# EAGLE schematic amp01 (EAGLE 6.1)
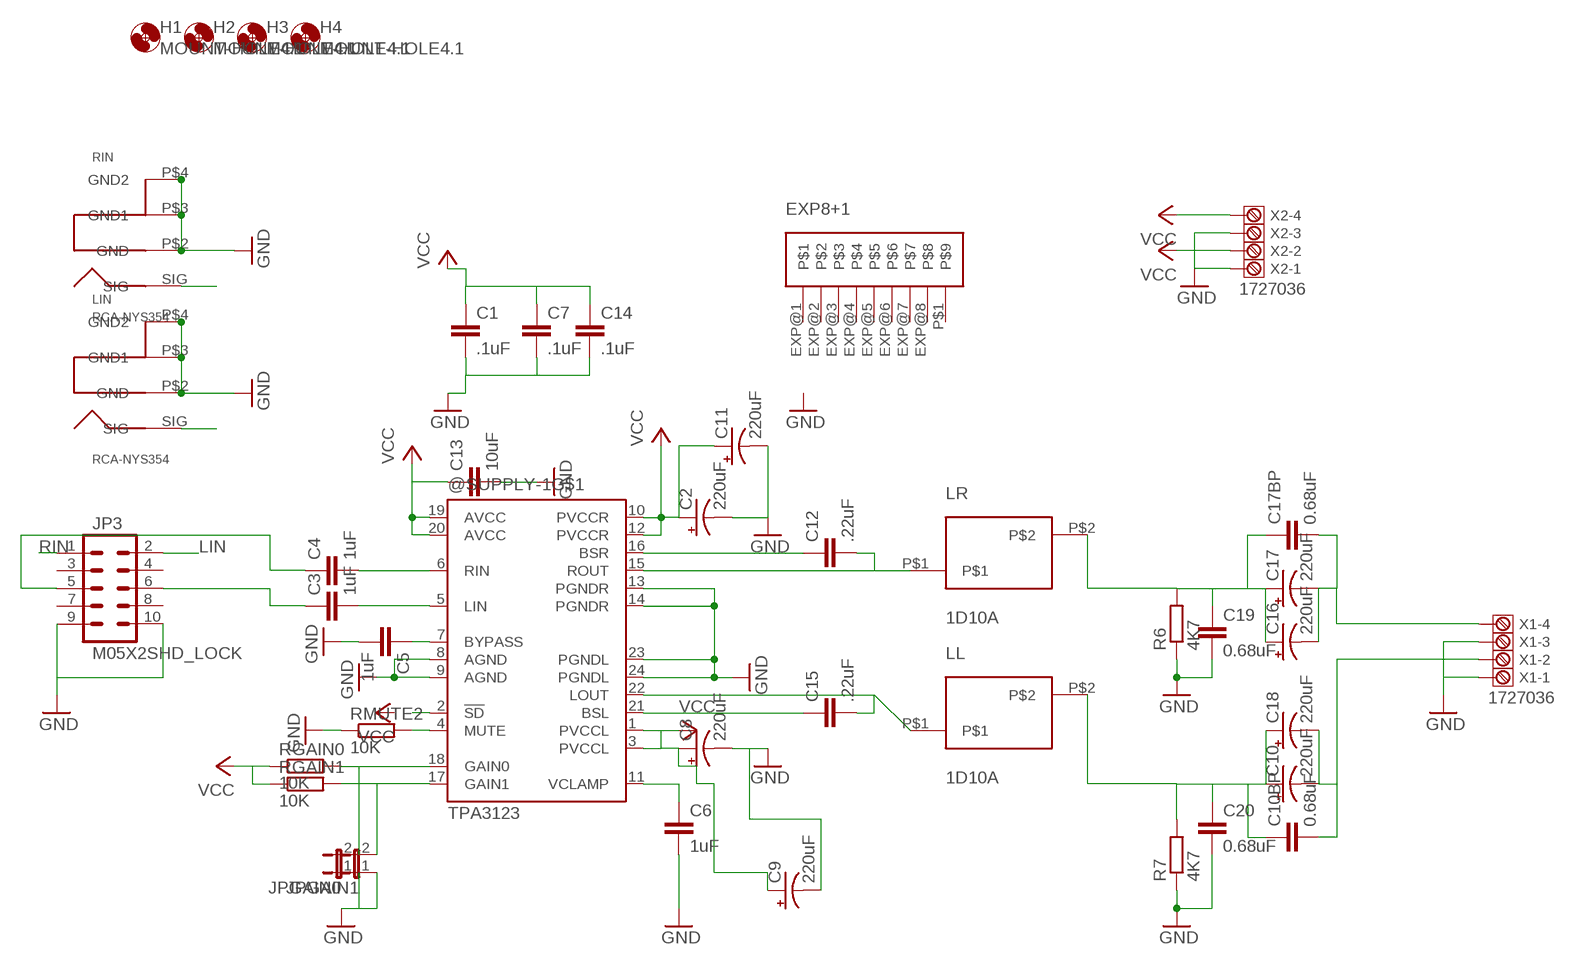
[diagram p0: schematic, sheet 1]

## Parts
@SUPPLY-1  TPA3123  [PWP-TSSOP24]
C1  .1uF  C-EUC0805  [C0805]
C2  220uF  CPOL-USF  [PANASONIC_F]
C3  1uF  C-EU102_152-062X184  [C102_152-062X184]
C4  1uF  C-EU102_152-062X184  [C102_152-062X184]
C5  1uF  C-EUC0805  [C0805]
C6  1uF  C-EUC0805  [C0805]
C7  .1uF  C-EUC0805  [C0805]
C8  220uF  CPOL-USF  [PANASONIC_F]
C9  220uF  CPOL-USF  [PANASONIC_F]
C10  220uF  CPOL-USF  [PANASONIC_F]
C10BP  0.68uF  C-EU050-055X075  [C050-055X075]
C11  220uF  CPOL-USF  [PANASONIC_F]
C12  .22uF  C-EUC0805  [C0805]
C13  10uF  C-EUC1210  [C1210]
C14  .1uF  C-EUC0805  [C0805]
C15  .22uF  C-EUC0805  [C0805]
C16  220uF  CPOL-USF  [PANASONIC_F]
C17  220uF  CPOL-USF  [PANASONIC_F]
C17BP  0.68uF  C-EU050-055X075  [C050-055X075]
C18  220uF  CPOL-USF  [PANASONIC_F]
C19  0.68uF  C-EU050-055X075  [C050-055X075]
C20  0.68uF  C-EU050-055X075  [C050-055X075]
H1  MOUNT-HOLE4.1  [4,1]
H2  MOUNT-HOLE4.1  [4,1]
H3  MOUNT-HOLE4.1  [4,1]
H4  MOUNT-HOLE4.1  [4,1]
JP3  M05X2SHD_LOCK  [2X5-SHROUDED_LOCK]
JPGAIN0  JUMPER-2PTH_LOCK  [1X02_LOCK]
JPGAIN1  JUMPER-2PTH_LOCK  [1X02_LOCK]
LIN  RCA-NYS354  [NYS354]
LL  1D10A  [1D10APAC]
LR  1D10A  [1D10APAC]
R6  4K7  R-EU_R0805  [R0805]
R7  4K7  R-EU_R0805  [R0805]
RGAIN0  10K  R-EU_R0805  [R0805]
RGAIN1  10K  R-EU_R0805  [R0805]
RIN  RCA-NYS354  [NYS354]
RMUTE2  10K  R-EU_R0805  [R0805]
X1  1727036  [1727036]
X2  1727036  [1727036]

## Nets
GND: @SUPPLY-1.8(AGND) @SUPPLY-1.9(AGND) @SUPPLY-1.13(PGNDR) @SUPPLY-1.14(PGNDR) @SUPPLY-1.23(PGNDL) @SUPPLY-1.24(PGNDL) C1.2 C2.- C5.2 C6.2 C7.2 C8.- C9.- C11.- C13.2 C14.2 C19.2 C20.2 JP3.9 JP3.10 JPGAIN0.1 JPGAIN1.1 LIN.P$2(GND) LIN.P$3(GND1) LIN.P$4(GND2) R6.1 R7.1 RIN.P$2(GND) RIN.P$3(GND1) RIN.P$4(GND2) RMUTE2.1 X1.1 X1.3 X2.1 X2.3
LIN: JP3.2 LIN.SIG
N$1: @SUPPLY-1.6(RIN) C4.2
N$2: @SUPPLY-1.5(LIN) C3.2
N$3: C3.1 JP3.6
N$4: C4.1 JP3.5
N$5: @SUPPLY-1.11(VCLAMP) C6.1
N$6: @SUPPLY-1.4(MUTE) RMUTE2.2
N$7: @SUPPLY-1.18(GAIN0) JPGAIN0.2 RGAIN0.2
N$8: @SUPPLY-1.17(GAIN1) JPGAIN1.2 RGAIN1.2
N$9: @SUPPLY-1.7(BYPASS) C5.1
N$10: @SUPPLY-1.15(ROUT) C12.2 LR.P$1
N$11: @SUPPLY-1.16(BSR) C12.1
N$12: @SUPPLY-1.22(LOUT) C15.2 LL.P$1
N$13: @SUPPLY-1.21(BSL) C15.1
N$14: C10.+ C10BP.1 C18.+ C20.1 LL.P$2 R7.2
N$15: C16.- C17.- C17BP.2 X1.4
N$16: C10.- C10BP.2 C18.- X1.2
N$17: C16.+ C17.+ C17BP.1 C19.1 LR.P$2 R6.2
N$18: @SUPPLY-1.2(!SD)
RIN: JP3.1 RIN.SIG
VCC: @SUPPLY-1.1(PVCCL) @SUPPLY-1.3(PVCCL) @SUPPLY-1.10(PVCCR) @SUPPLY-1.12(PVCCR) @SUPPLY-1.19(AVCC) @SUPPLY-1.20(AVCC) C1.1 C2.+ C7.1 C8.+ C9.+ C11.+ C13.1 C14.1 RGAIN0.1 RGAIN1.1 X2.2 X2.4
Unconnected: @SUPPLY-1.EXP@1 @SUPPLY-1.EXP@2 @SUPPLY-1.EXP@3 @SUPPLY-1.EXP@4 @SUPPLY-1.EXP@5 @SUPPLY-1.EXP@6 @SUPPLY-1.EXP@7 @SUPPLY-1.EXP@8 @SUPPLY-1.P$1 JP3.3 JP3.4 JP3.7 JP3.8

## Library data of the parts
@SUPPLY-1 = texas:TPA3123
C1 C3-C7 C10BP C12-C15 C17BP C19 C20 = rcl:C-EU: CAPACITOR, European symbol
C2 C8-C11 C16-C18 = rcl:CPOL-US: POLARIZED CAPACITOR, American symbol
H1-H4 = holes:MOUNT-HOLE: MOUNTING HOLE with drill center marker
JP3 = SparkFun-Connectors:M05X2: Header 5x2 Standard 10-pin dual row 0.1" header. Commonly used with AVR-ISP. Use with Spark Fun Electronics SKU: PRT-00778
JPGAIN0 JPGAIN1 = SparkFun-Passives:JUMPER-2: Jumper Basic 0.1" spaced jumper. Use with breakaway headers.
LIN RIN = wes:RCA-NYS354
LL LR = wes:1D10A
R6 R7 RGAIN0 RGAIN1 RMUTE2 = rcl:R-EU_: RESISTOR, European symbol
X1 X2 = con-phoenix-3.81:1727036: MKDS 1/4-3,81 Source: http://eshop.phoenixcontact.de; MF: FARNELL; MPN: 1727036; OC_FARNELL: 3704592; OC_NEWARK: 71C4114